# Altium project AJAX_PR1.PrjPcb
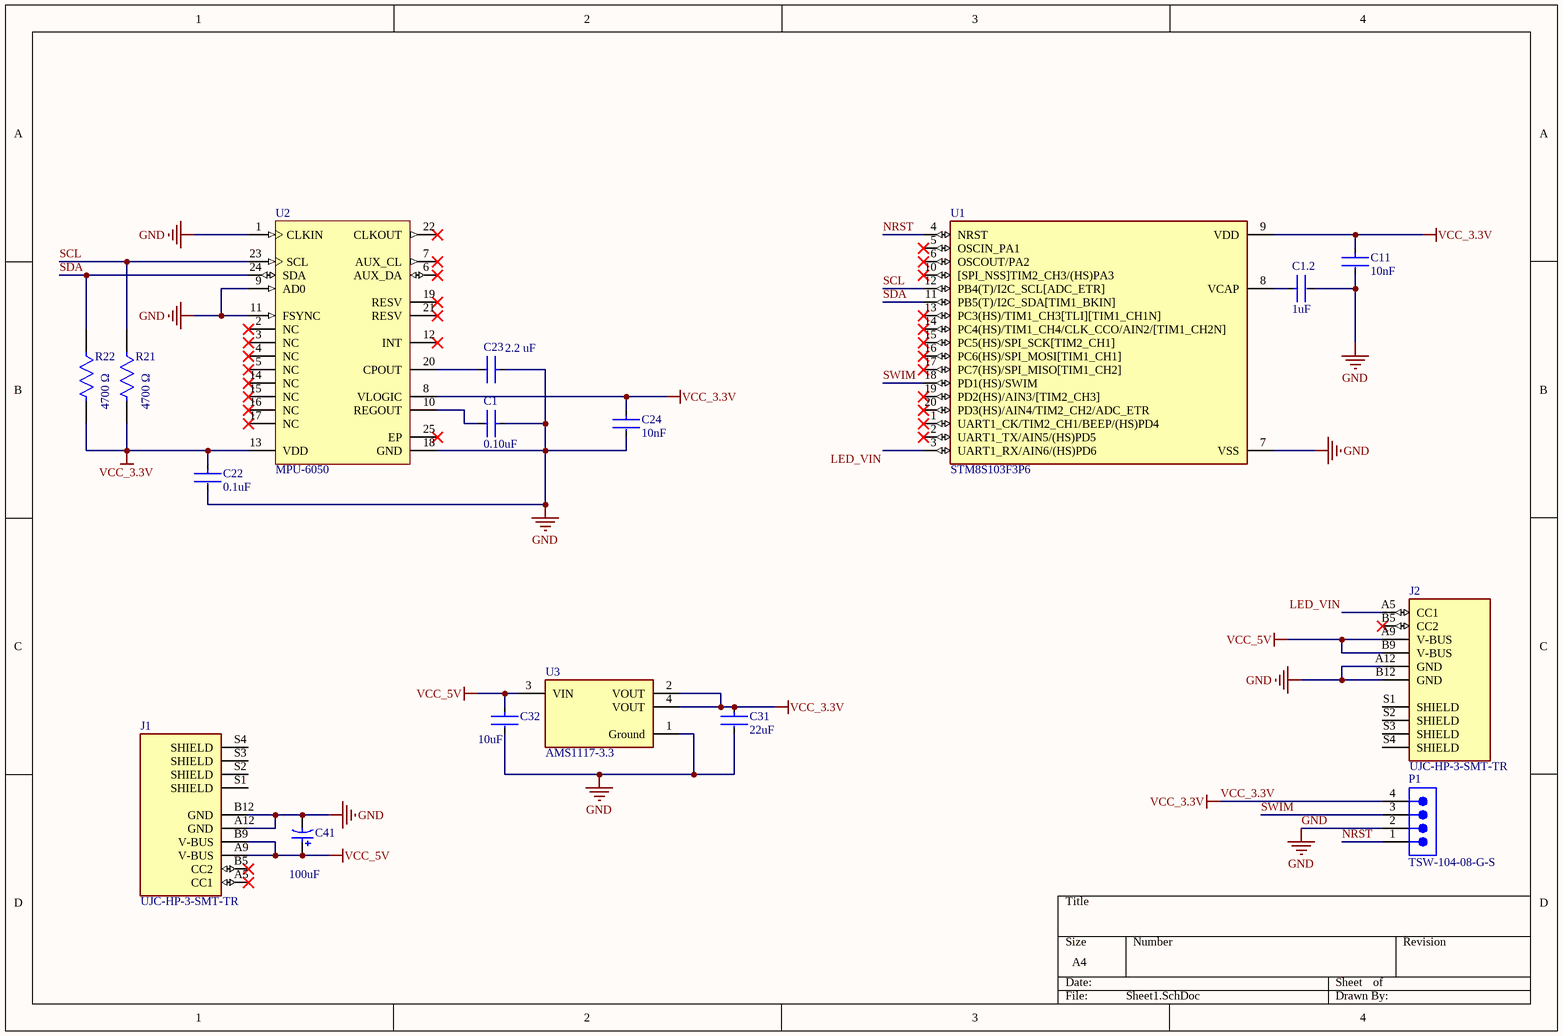
[diagram p0: Sheet1.SchDoc]
1 sheet, 17 parts. Net scope: global (net labels, ports and power ports of the same name join across sheets).

## Sheet Sheet1.SchDoc
size A4; SheetNumber: 1; SheetTotal: 1

### Parts
C1  0.10uF  [FP-GRM033-0_03-IPC_A]
C1.2  1uF  [FP-GCG31C-0_3-IPC_A]
C11  10nF  [FP-GRM155-0_05-IPC_C]
C22  0.1uF  [FP-GRM033-0_03-IPC_A]
C23  2.2 uF  [FP-CGA6P-IPC_C]
C24  10nF  [FP-GRM155-0_05-IPC_C]
C31  22uF  [FP-GRM188-0_2-IPC_C]
C32  10uF  [FP-GRM188-0_1-e0_2_0_55-IPC_A]
C41  100uF  [PNSC-FK-V-D8_V]
J1  UJC-HP-3-SMT-TR  [CUI_UJC-HP-3-SMT-TR]
J2  UJC-HP-3-SMT-TR  [CUI_UJC-HP-3-SMT-TR]
P1  TSW-104-08-G-S  [SMTC-TSW-104-08-X-S]
R21  4700 Ω  [FP-RC1206-0_65-IPC_B]
R22  4700 Ω  [FP-RC1206-0_65-IPC_B]
U1  STM8S103F3P6  [SOP65P640X120-20N]
U2  MPU-6050  [IS-QFN-24_V]
U3  AMS1117-3.3  [FP-AMS1117-IPC_C]

### Nets
GND: C1.1 C1.2.2 C11.2 C22.2 C23.1 C24.2 C31.2 C32.2 C41.2 J1.A12(GND) J1.B12(GND) J2.A12(GND) J2.B12(GND) P1.2 U1.7(VSS) U2.1(CLKIN) U2.9(AD0) U2.11(FSYNC) U2.18(GND) U3.1(Ground)
VCC_3.3V: C11.1 C22.1 C24.1 C31.1 P1.4 R21.2 R22.2 U1.9(VDD) U2.8(VLOGIC) U2.13(VDD) U3.2(VOUT) U3.4(VOUT)
VCC_5V: C32.1 C41.1 J1.A9(V-BUS) J1.B9(V-BUS) J2.A9(V-BUS) J2.B9(V-BUS) U3.3(VIN)
LED_VIN: J2.A5(CC1) U1.3(UART1_RX/AIN6/(HS)PD6)
NRST: P1.1 U1.4(NRST)
SCL: R21.1 U1.12(PB4(T)/I2C_SCL[ADC_ETR]) U2.23(SCL)
SDA: R22.1 U1.11(PB5(T)/I2C_SDA[TIM1_BKIN]) U2.24(SDA)
SWIM: P1.3 U1.18(PD1(HS)/SWIM)
NetC1.2_1: C1.2.1 U1.8(VCAP)
NetC1_2: C1.2 U2.10(REGOUT)
NetC23_2: C23.2 U2.20(CPOUT)

Not connected (* = marked no-connect by the designer): J1 A5(CC1)* B5(CC2)* S1(SHIELD) S2(SHIELD) S3(SHIELD) S4(SHIELD); J2 B5(CC2)* S1(SHIELD) S2(SHIELD) S3(SHIELD) S4(SHIELD); U1 1(UART1_CK/TIM2_CH1/BEEP/(HS)PD4)* 2(UART1_TX/AIN5/(HS)PD5)* 5(OSCIN_PA1)* 6(OSCOUT/PA2)* 10([SPI_NSS]TIM2_CH3/(HS)PA3)* 13(PC3(HS)/TIM1_CH3[TLI][TIM1_CH1N])* 14(PC4(HS)/TIM1_CH4/CLK_CCO/AIN2/[TIM1_CH2N])* 15(PC5(HS)/SPI_SCK[TIM2_CH1])* 16(PC6(HS)/SPI_MOSI[TIM1_CH1])* 17(PC7(HS)/SPI_MISO[TIM1_CH2])* 19(PD2(HS)/AIN3/[TIM2_CH3])* 20(PD3(HS)/AIN4/TIM2_CH2/ADC_ETR)*; U2 2(NC)* 3(NC)* 4(NC)* 5(NC)* 6(AUX_DA)* 7(AUX_CL)* 12(INT)* 14(NC)* 15(NC)* 16(NC)* 17(NC)* 19(RESV)* 21(RESV)* 22(CLKOUT)* 25(EP)*

### Library data of the parts
C1 C22 = CMP-2010-01241-2: Chip Multilayer Ceramic Capacitors for General Purpose, 0201, 0.10uF, X6S, 22%, 10%, 4V; Capacitance: 100nF; Thickness: 0.013inch; Case Code (Metric): 0603; Dielectric: X6S; Max Operating Temperature: 105°C; Width: 0.012inch; Packaging: Tape and Reel; Length: 0.6mm; Height: 0.3mm; Case Code (Imperial): 0201; Tolerance: 10%; Radiation Hardening: No; Termination: SMD/SMT; Min Operating Temperature: -55°C; Package Quantity: 1; Lead Free: Lead Free; Depth: 0.3mm; Mount: Surface Mount; Case/Package: 0201; Voltage Rating: 4V; Voltage Rating (DC): 4V
C1.2 = CMP-06035-041741-1: AgPd Termination Conductive Glue Mounting Chip Multilayer Ceramic Capacitors for Automotive 1206 Package, X8R 15% 16V 1uF 20%
C11 C24 = CMP-2008-04637-5: Chip Multilayer Ceramic Capacitors for General Purpose, 0402, 10000pF, X7R, 15%, 10%, 50V; Voltage: 25V; Tolerance: 10%; Mount: Surface Mount; Lead Free: Lead Free; Radiation Hardening: No; Case Code (Imperial): 0402; REACH SVHC: No SVHC; Case/Package: 0402; Dielectric: X7R; Voltage Rating (DC): 50V; Max Operating Temperature: 125°C; Termination: SMD/SMT; Material: Ceramic; Width: 0.02inch; Package Quantity: 1; Voltage Rating: 50V; Thickness: 0.022inch; Packaging: Tape and Reel; Height: 0.5mm; Number of Pins: 2; Case Code (Metric): 1005; Min Operating Temperature: -55°C; Length: 1mm; Capacitance: 10nF; Depth: 0.5mm
C23 = CMP-08246-000149-1: Cap Ceramic 2.2uF 50V X7R 10% Pad SMD 1210 +125°C Automotive T/R; Composition: Ceramic; Ratings: AEC-Q200; Depth: 2.5mm; Voltage Rating (DC): 50V; Dielectric: X7R; Packaging: Tape and Reel; Case Code (Metric): 3225; Mount: Surface Mount; Case/Package: 1210; Package Quantity: 1; Thickness: 0.087inch; Weight: 0.000564oz; Case Code (Imperial): 1210; Length: 3.2mm; REACH SVHC: No SVHC; Termination: SMD/SMT; Max Operating Temperature: 125°C; Voltage Rating: 50V; Height: 2mm; Capacitance: 2.2uF; Width: 2.5mm; Tolerance: 10%; Lead Free: Lead Free; Min Operating Temperature: -55°C
C31 = CMP-2000-06337-3: Chip Multilayer Ceramic Capacitors for General Purpose, 0603, 22uF, X5R, 15%, 20%, 10V; Tolerance: 20%; Weight: 0.000222oz; Material: Ceramic; Depth: 0.8mm; Length: 1.6mm; Termination: SMD/SMT; Capacitance: 22uF; Packaging: Tape and Reel; Width: 0.8mm; Voltage Rating: 10V; Case Code (Imperial): 0603; Mount: Surface Mount; Voltage Rating (DC): 10V; Case/Package: 0603; Thickness: 0.039inch; REACH SVHC: No SVHC; Dielectric: X5R; Height: 0.8mm; Package Quantity: 4000; Case Code (Metric): 1608; Min Operating Temperature: -55°C; Lead Free: Lead Free; Max Operating Temperature: 85°C
C32 = CMP-2006-02792-2: Chip Multilayer Ceramic Capacitors for General Purpose, 0603, 10uF, X5R, 15%, 20%, 6.3V; Packaging: Tape and Reel; Voltage Rating (DC): 6.3V; Width: 0.031inch; Termination: SMD/SMT; Dielectric: X5R; Package Quantity: 4000; Voltage Rating: 6.3V; Capacitance: 10uF; Case/Package: 0603; Min Operating Temperature: -55°C; Voltage: 6.3V; Length: 1.6mm; Thickness: 0.035inch; Lead Free: Lead Free; Depth: 0.8mm; Case Code (Imperial): 0603; Max Operating Temperature: 85°C; Material: Ceramic; Height: 0.8mm; Tolerance: 20%; Mount: Surface Mount; REACH SVHC: No SVHC; Radiation Hardening: No; Case Code (Metric): 1608
C41 = CMP-2000-06206-1: Aluminum Electrolytic Capacitor, 100 uF, +/- 20%, 25 V, 2-Pin SMD (Size Code D8), -55 to 105 degC, RoHS, Tape and Reel; Manufacturer: Panasonic; Type: Can; Lifetime@Temperature: 2000Hrs@105°C; Capacitance: 100µF; Rated Voltage: 25V; Ripple Current: 280mA; Impedance: 0.34O; Case Size/Dimension: Ø6.3x7.7mm; Operating Temp-Max: 105°C; Series: FK; Package URL: http://industrial.panasonic.com/cdbs/www-data/pdf/RDE0000/DME0000COL48.pdf; Mounting Technology: SurfaceMount; Package Description: 2-Pin Electrolytic Aluminum Capacitor, Body 6.6 x 6.6 mm; Datasheet Version: 03/2016; Datasheet URL: http://industrial.panasonic.com/cdbs/www-data/pdf/RDE0000/ABA0000C1181.pdf; Manufacturer URL: http://www.panasonic.com/; Package Reference: FK-V-D8; Operating Temp Range: -55to+105°C
P1 = CMP-1024-00357-1: 0.025" SQ Post Header, Through-hole, Vertical, -55 to 125 degC, 2.54 mm Pitch, 4-Pin, Male, RoHS; Manufacturer: Samtec; Pitch: 2.54 mm; RoHS: True; ComponentLink3URL: http://www.samtec.com/documents/webfiles/cpdf/TSW-XXX-XX-XXX-X-XX-XXX-MKT.pdf; Mounting Technology: Through-hole; ComponentLink2URL: http://www.samtec.com/documents/webfiles/pdf/TSW_TH.PDF; ComponentLink1URL: http://www.samtec.com; ComponentLink3Description: Package Specification; PackageVersion: DM, 8/1988; ComponentLink2Description: Datasheet; PackageReference: TSW-104-08-X-S; PackageDescription: .025[0.64] SQ. Post Terminal Strip Assembly; PartNumber: TSW-104-08-G-S; ComponentLink1Description: Manufacturer URL; Temperature Range: -55 to 125 degC; DatasheetVersion: F-214; Orientation: Vertical
R21 R22 = CMP-03412-037805-1: RES SMD 4.7K OHM 1% 1/4W 1206; Max Power Dissipation: 250mW; Voltage Rating: 200V; Temperature Coefficient: 100ppm/°C; Resistance: 4.7kR; Construction: Rectangular; RoHS Compliant: Yes; Max Operating Temperature: 155°C; Tolerance: 1%; Height: 0.026inch; Features: Moisture Resistant; Military Standard: Not; Series: RC; Termination: SMD/SMT; Number of Terminations: 2; Number of Pins: 2; Case Code (Imperial): 1206; Case/Package: 1206; Case Code (Metric): 3216; Voltage Rating (DC): 200V; Width: 0.063inch; Min Operating Temperature: -55°C; Resistance Tolerance: 1%; Length: 0.122inch; Size Code: 1206; Lead Free: Lead Free; Depth: 1.6mm; Packaging: Tape and Reel; Package Quantity: 1; Power Rating: 250mW; Resistor Type: Thick Film
U1 = STM8S103F3P6: STM8 series Microcontroller IC 8-Bit 16MHz 8KB (8K x 8) FLASH 20-TSSOP; MF: STMicroelectronics; SnapEDA_Link: https://www.snapeda.com/parts/STM8S103F3P6/STMicroelectronics/view-part/?ref=snap; Package: TSSOP-20 STMicroelectronics; Value: *; MP: STM8S103F3P6; Check_prices: https://www.snapeda.com/parts/STM8S103F3P6/STMicroelectronics/view-part/?ref=eda
U2 = CMP-1753-00002-2: 3-Axis Gyroscope, Accelerometer and a Digital Motion Processor(TM) (DMP), 2.375 to 3.46 V, -40 to 85 degC, 24-Pin QFN, RoHS, Tape and Reel; Manufacturer: InvenSense; Featured Product: MPU-60506-Axis,IntegratedI²CSolution; Other Names: 1428-1007-2 / MPU6050; Sensor Type: MotionTracking; Online Catalog: MPU-6000™Series; Unit PriceUSD: Digital; Datasheet Version: Rev. 3.3, 05/2012; Category: Sensors,Transducers; Datasheet URL: http://datasheet.octopart.com/MPU-6050-InvenSense-datasheet-14421344.pdf; Family: Multifunction; Standard Package: 5,000; Manufacturer URL: http://www.invensense.com/; Output Type: Digital; Dynamic Catalog: MPU-6000™Series
U3 = CMP-209535-000001-1: LDO Voltage Regulators 1A, 3.3V; Manufacturer: Advanced Monolithic Systems; Dropout Voltage: 1.1V; Output Type: Fixed; Nominal Supply Current: 5mA; Max Power Dissipation: 1.2W; Max Supply Voltage: 15V; Number Of Outputs: 1; Standoff Height: 0.64mm; Max Junction Temp: +125°C; Height: 1.8mm; Package: AMS1117; Device Class L2: Power Management ICs; ComponentLink2Description: Datasheet; ComponentLink2URL: http://www.advanced-monolithic.com/pdf/ds1117.pdf; Category: IC; RoHS: TRUE; Automotive: No; Device Class L1: Integrated Circuits (ICs); Output Current: 1A; Device Class L3: Voltage Regulators - Linear; Temperature: -40°C to +125°C; Output Voltage: 3.3V; Manufacturer Part Number: AMS1117-3.3; Temperature Range Low: -40°C; Octopart: https://octopart.com/ams1117-3.3-advanced+monolithic+systems-25899300; Lead Free: Yes; Ipc Land Pattern Name: SOT229P700X180-4; Temperature Range High: +125°C
J1 J2 = UJC-HP-3-SMT-TR: Package: None; Price: None; Value: *; MP: UJC-HP-3-SMT-TR; Availability: Unavailable